# Altium schematic sheet RLY.SchDoc
size A4; SheetNumber: 8; SheetTotal: 10
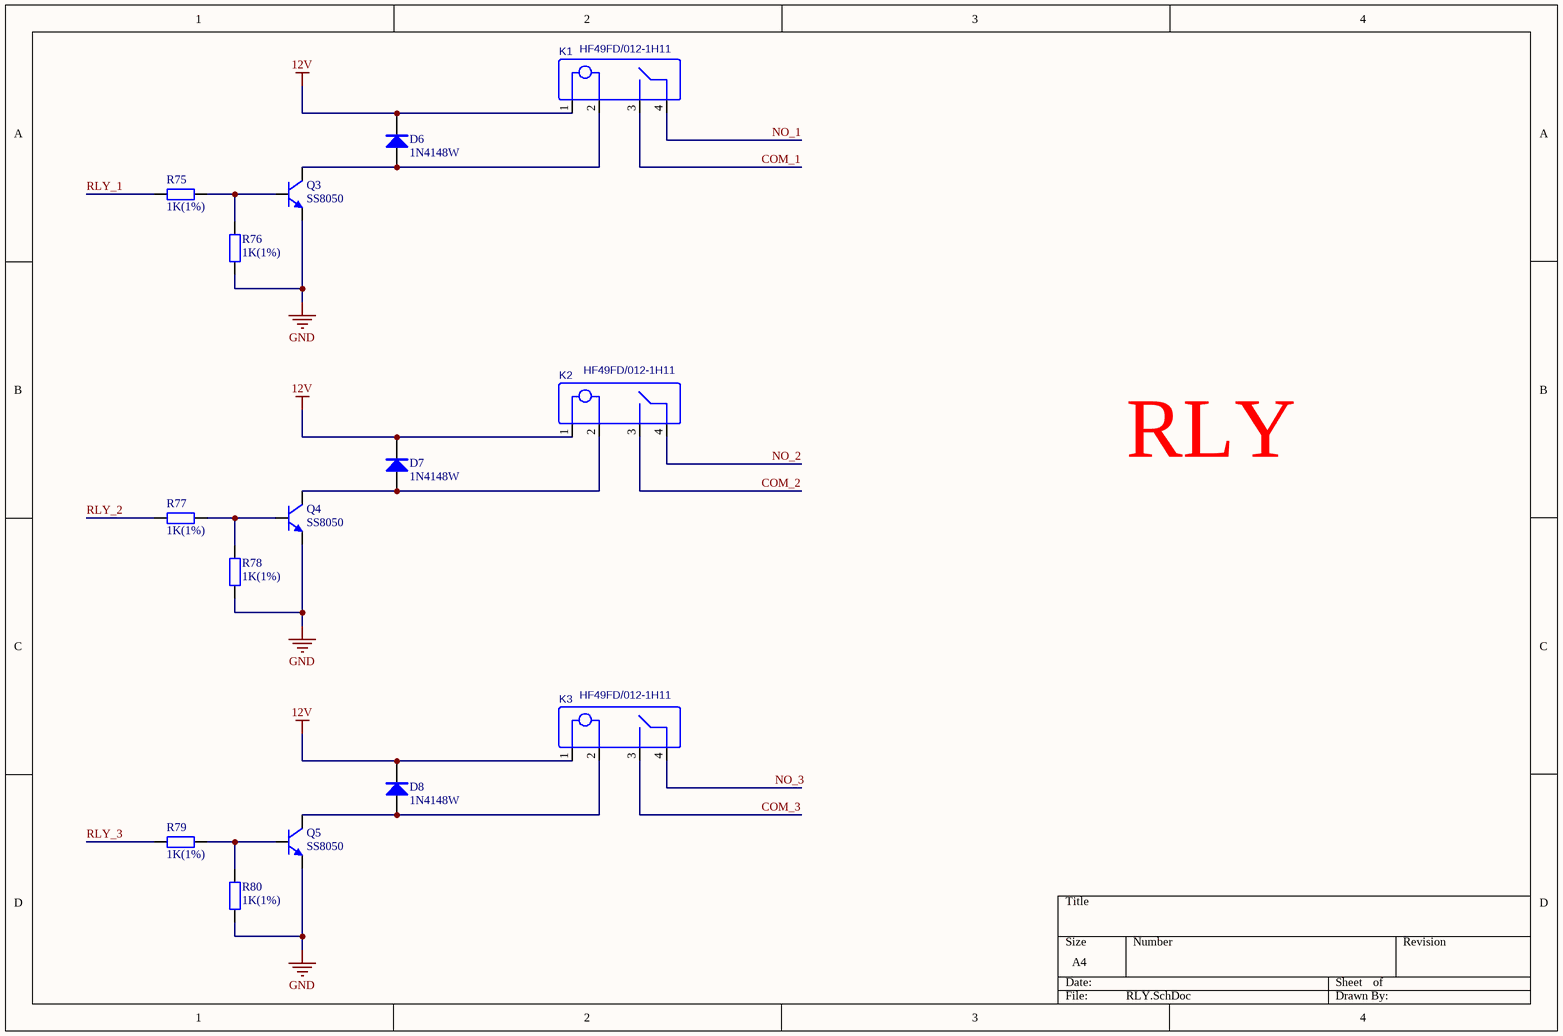
[diagram p0: RLY.SchDoc]

## Parts
D6  1N4148W  [SOD-123]
D7  1N4148W  [SOD-123]
D8  1N4148W  [SOD-123]
K1  HF49FD/012-1H11  [RELAY-TH_HF49FD-XXX-1H11-XXX]
K2  HF49FD/012-1H11  [RELAY-TH_HF49FD-XXX-1H11-XXX]
K3  HF49FD/012-1H11  [RELAY-TH_HF49FD-XXX-1H11-XXX]
Q3  SS8050  [SOT23-3N]
Q4  SS8050  [SOT23-3N]
Q5  SS8050  [SOT23-3N]
R75  1K(1%)  [R 0603_L]
R76  1K(1%)  [R 0603_L]
R77  1K(1%)  [R 0603_L]
R78  1K(1%)  [R 0603_L]
R79  1K(1%)  [R 0603_L]
R80  1K(1%)  [R 0603_L]

## Nets
12V: D6.2(K) D7.2(K) D8.2(K) K1.1 K2.1 K3.1
GND: Q3.2(E) Q4.2(E) Q5.2(E) R76.1 R78.1 R80.1
COM_1: K1.3
COM_2: K2.3
COM_3: K3.3
NO_1: K1.4
NO_2: K2.4
NO_3: K3.4
RLY_1: R75.2
RLY_2: R77.2
RLY_3: R79.2
NetD6_1: D6.1(A) K1.2 Q3.3(C)
NetD7_1: D7.1(A) K2.2 Q4.3(C)
NetD8_1: D8.1(A) K3.2 Q5.3(C)
NetQ3_1: Q3.1(B) R75.1 R76.2
NetQ4_1: Q4.1(B) R77.1 R78.2
NetQ5_1: Q5.1(B) R79.1 R80.2

## Notes on the sheet
- RLY

## Library data of the parts
D6-D8 = 1N4148: 高速开关二极管; 版权归属: 源创客; BOM名称: 高速开关二极管; 学习资源: www.ooocke.com
K1-K3 = HF49FD/012-1H11: BOM_Manufacturer: Xiamen Hongfa Electroacoustic; BOM_Manufacturer Part: HF49FD/012-1H12; Contributor: LCSC; BOM_Supplier: LCSC; BOM_Supplier Part: C399491; BOM_JLCPCB Part Class: Extended Part; spicePre: K; spiceSymbolName: HF49FD/012-1H12
Q3-Q5 = 8050-SMD: 高频放大-NPN型; 版权归属: 源创客; 属性: 40V 1.5A 1W 100MHZ; BOM名称: 高频放大-NPN型; 学习资源: www.ooocke.com
R75-R80 = R: 贴片电阻; 版权归属: 源创客; BOM名称: 贴片电阻; 学习资源: www.ooocke.com